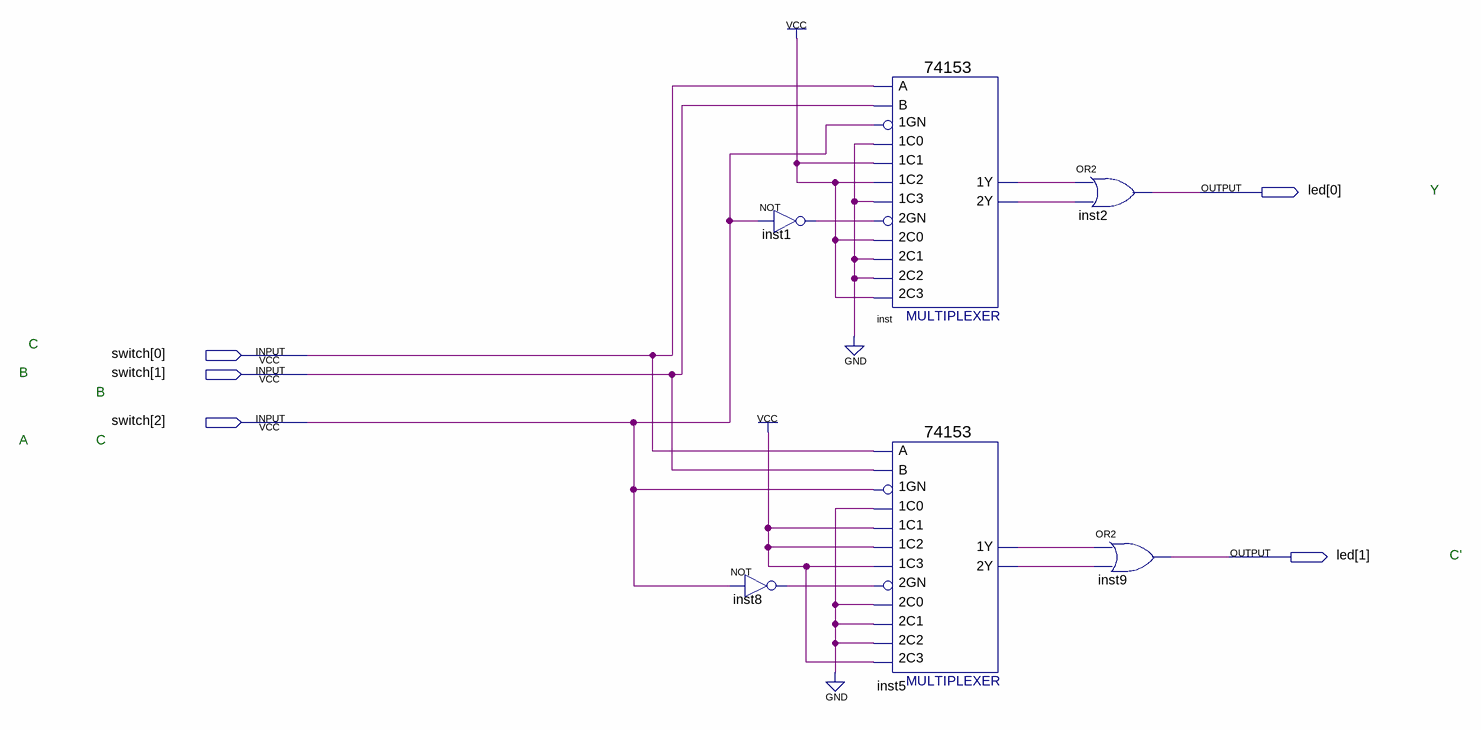
[diagram p0: schematic sheet]
// Quartus schematic pj404_2.bdf as structural Verilog: 6 symbols, 5 pins
module pj404_2 (
  input  [2:0] switch,
  output [1:0] led
);

  wire inst1_out, inst5_1y, inst5_2y, inst8_out, inst_1y, inst_2y;

  not inst8 (inst8_out, switch[2]);
  not inst1 (inst1_out, switch[2]);
  \74153  inst (
    .\1C1 (1'b1), .\1GN (switch[2]), .\1C0 (1'b0), .\2C0 (1'b1), .\2GN (inst1_out), .\2C2 (1'b0),
    .\1C2 (1'b1), .\1C3 (1'b0), .B(switch[1]), .A(switch[0]), .\2C1 (1'b0), .\2C3 (1'b1), .\1Y (inst_1y),
    .\2Y (inst_2y));
  \74153  inst5 (
    .\1C1 (1'b1), .\1GN (switch[2]), .\1C0 (1'b0), .\2C0 (1'b0), .\2GN (inst8_out), .\2C2 (1'b0),
    .\1C2 (1'b1), .\1C3 (1'b1), .B(switch[1]), .A(switch[0]), .\2C1 (1'b0), .\2C3 (1'b1), .\1Y (inst5_1y),
    .\2Y (inst5_2y));
  or inst2 (led[0], inst_1y, inst_2y);
  or inst9 (led[1], inst5_1y, inst5_2y);

  // Notes on the sheet:
  //   Y
  //   C
  //   B
  //   B
  //   A
  //   C
  //   C'
endmodule
